# EasyEDA Pro project AD8336程控增益模块.eprj

# Schematic Schematic1
Create Date: 2024-07-12; Page Name: P1; Project Name: AD8336程控增益模块; Schematic Name: Schematic1; Update Date: 2024-07-12; Company: 嘉立创EDA; Page Size: A4; Version: V1.0
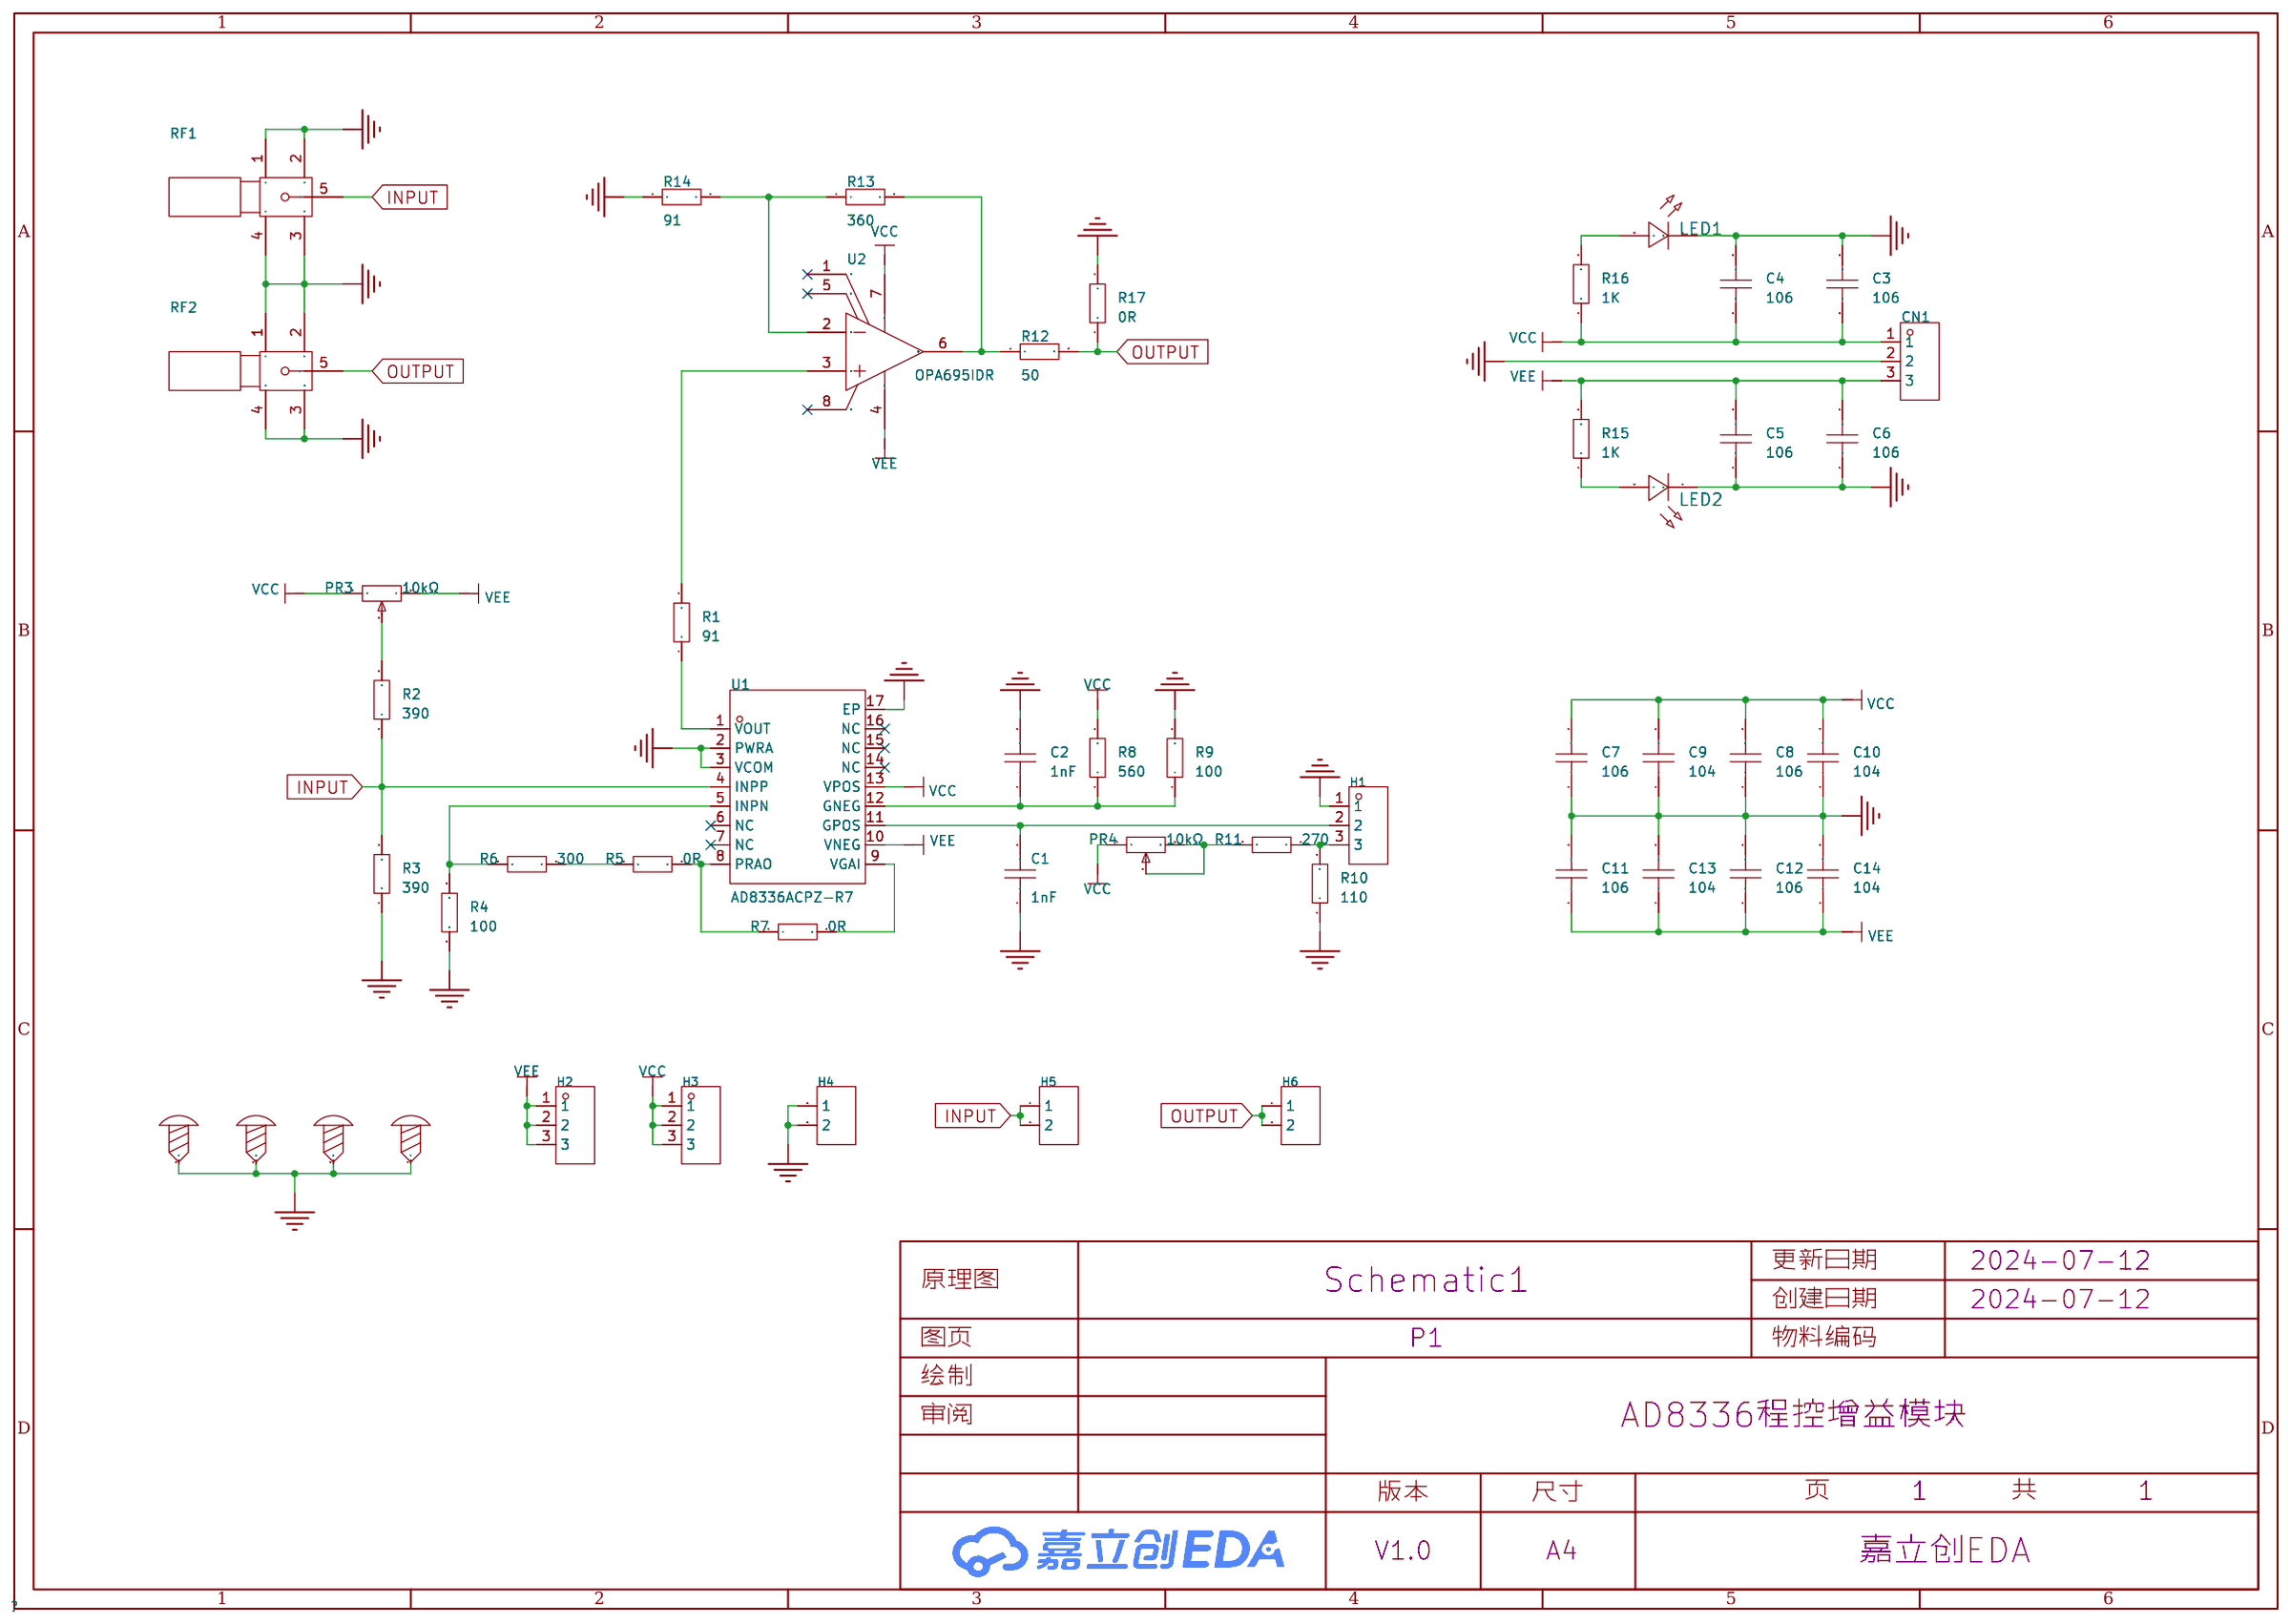
[diagram p0: schematic sheet]

## Parts
C1  1nF  [C0603]
C2  1nF  [C0603]
C3  106  [C0603]
C4  106  [C0603]
C5  106  [C0603]
C6  106  [C0603]
C7  106  [C0603]
C8  106  [C0603]
C9  104  [C0603]
C10  104  [C0603]
C11  106  [C0603]
C12  106  [C0603]
C13  104  [C0603]
C14  104  [C0603]
CN1  MX301-5.0-03P-BU01-Cu-Y-A  [CONN-TH_3P-P5.0-MX301-5.0-03P-BU01-CU-Y-A]
H1  -  [HDR-TH_3P-P2.54-V-F]
H2  -  [HDR-TH_3P-P2.54-V-F]
H3  -  [HDR-TH_3P-P2.54-V-F]
H4  -  [HDR-TH_2P-P2.54-V-F]
H5  -  [HDR-TH_2P-P2.54-V-F]
H6  -  [HDR-TH_2P-P2.54-V-F]
LED1  -  [LED_0603]
LED2  -  [LED_0603]
PR3  10kΩ  [R_3296]
PR4  10kΩ  [R_3296]
R1  91  [R0603]
R2  390  [R0603]
R3  390  [R0603]
R4  100  [R0603]
R5  0R  [R0603]
R6  300  [R0603]
R7  0R  [R0603]
R8  560  [R0603]
R9  100  [R0603]
R10  110  [R0603]
R11  270  [R0603]
R12  50  [R0603]
R13  360  [R0603]
R14  91  [R0603]
R15  1K  [R0603]
R16  1K  [R0603]
R17  0R  [R0603]
RF1  BWSMA-KE-Z001  [SMA-TH_BWSMA-KE-Z001]
RF2  BWSMA-KE-Z001  [SMA-TH_BWSMA-KE-Z001]
TP1  -  [M3螺丝]
TP2  -  [M3螺丝]
TP3  -  [M3螺丝]
TP4  -  [M3螺丝]
U1  AD8336ACPZ-R7  [LFCSP-16_L4.0-W4.0-P0.65-BL-EP2.2]
U2  OPA695IDR  [SOIC-8_L5.0-W4.0-P1.27-LS6.1-BL]

## Library data of the parts
C1-C14 = CAP_0603: Supplier Footprint: 0603
CN1 = MX301-5.0-03P-BU01-Cu-Y-A: 结构:1x3P;间距:5mm;颜色:蓝色;安装方式:直插;额定电流:16A;额定电压:300V;排数:1;线规 - AWG:14~24;线规 - 平方毫米:1.5;每排PIN数:3;触头材质:铜合金;触头镀层:锡;工作温度范围:-40℃~+105℃;; LCSC Part Name: 5mm 1x3P 排数:1 每排P数:3 直插; Supplier Part: C5188423; Manufacturer: MAX(迈旭); Supplier Footprint: 插件,P=5mm; JLCPCB Part Class: Extended Part; Datasheet: https://atta.szlcsc.com/upload/public/pdf/source/20230915/1F0A484E8C4B07E7C9BE20D191F8A304.pdf; Supplier: LCSC; Structure: 1x3P; Pitch: 5mm; Color: 蓝色; Mounting Style: 直插; Current Rating (Max): 16A; Voltage Rating (Max): 300V; Number of Pins: 3P; Number of Rows: 1; Wire Gauge - AWG: 14~24; Wire Gauge - mm2: 1.5; Number of PINs Per Row: 3; Contact Material: 铜合金; Contact Plating: 锡; Operating Temperature Range: -40℃~+105℃
H1-H3 = HDR-F_2.54_1x3P: Supplier Part: C541850; Supplier Footprint: 插件
H4-H6 = HDR-F_2.54_1x2P: Supplier Part: C49661; Supplier Footprint: 插件
LED1 LED2 = LED_0603-R: Supplier Footprint: 0603
PR3 PR4 = R_3296: Supplier Footprint: 直插
R1-R17 = Res_0603: Supplier Footprint: 0603
RF1 RF2 = BWSMA-KE-Z001_C496549: 连接器类型:板端;接口类型:内孔;端口数量:1;接口直径:-;接口长度/高度:-;频率-最大值:-;射频系列:SMA;阻抗:50Ω;样式:正脚;触头材质:-;触头镀层:-;工作温度范围:-65℃~+165℃;焊接温度(最大值):-;; LCSC Part Name: 内孔 SMA 正脚; Supplier Part: C496549; Manufacturer: BAT WIRELESS(蝙蝠无线); Supplier Footprint: 插件; JLCPCB Part Class: 扩展库; Datasheet: https://atta.szlcsc.com/upload/public/pdf/source/20221228/40BF41E56A06003A0210E1785CA66EA6.pdf; Supplier: LCSC; Connector Type: 板端; Interface Type: 内孔; Number of Ports: 1; RF Series: SMA; Impedance: 50Ω; Style: 正脚; Operating Temperature Range: -65℃~+165℃
TP1-TP4 = M3螺丝: Supplier Footprint: 插件
U1 = AD8336ACPZ-R7: 可变增益放大器-IC-信号处理-16-LFCSP-VQ（4x4）; Supplier Part: C578700; Manufacturer: ADI(亚德诺); Supplier Footprint: LFCSP-16(4x4); JLCPCB Part Class: 扩展库; Datasheet: https://atta.szlcsc.com/upload/public/pdf/source/20200820/C652712_CB62F1C22C6353105F16C6BF364AA7F1.pdf; Supplier: LCSC
U2 = OPA695IDR: 放大器数:单路;增益带宽积(GBP):-;输入偏置电流(Ib):20uA;压摆率(SR):4300V/us;带宽(-3db):1.7GHz;; Supplier Part: C1848175; Manufacturer: TI(德州仪器); Supplier Footprint: SOIC-8; JLCPCB Part Class: 扩展库; Datasheet: https://www.ti.com/cn/lit/gpn/opa695; Supplier: LCSC; Number of Circuits: 单路; Current - Input Bias(Ib): 20uA; Slew Rate(SR): 4300V/us; Output Current: 120mA; -3db Bandwidth: 1.7GHz; Operating Temperature: -40℃~+85℃

## Nets
GND: C1.1 C2.2 C3.2 C4.2 C5.1 C6.1 C7.1 C8.1 C9.1 C10.1 C11.2 C12.2 C13.2 C14.2 CN1.2 H1.1 H4.1 H4.2 LED1.1(C) LED2.1(C) R3.1 R4.1 R9.2 R10.1 R14.1 R17.2 RF1.1 RF1.2 RF1.3 RF1.4 RF2.1 RF2.2 RF2.3 RF2.4 TP1.1 TP2.1 TP3.1 TP4.1 U1.2(PWRA) U1.3(VCOM) U1.17(EP)
VCC: C3.1 C4.1 C7.2 C8.2 C9.2 C10.2 CN1.1 H3.1 H3.2 H3.3 PR3.1 PR4.1 R8.2 R16.1 U1.13(VPOS) U2.7(+VS)
VEE: C5.2 C6.2 C11.1 C12.1 C13.1 C14.1 CN1.3 H2.1 H2.2 H2.3 PR3.3 R15.2 U1.10(VNEG) U2.4(-VS)
INPUT: H5.1 H5.2 R2.1 R3.2 RF1.5 U1.4(INPP)
OUTPUT: H6.1 H6.2 R12.2 R17.1 RF2.5
$1N575: PR3.2 R2.2
$1N856: R4.2 R6.1 U1.5(INPN)
$1N865: R5.1 R6.2
$1N898: R7.2 U1.9(VGAI)
$1N903: R5.2 R7.1 U1.8(PRAO)
$1N1123: C2.1 R8.1 R9.1 U1.12(GNEG)
$1N1473: PR4.2 PR4.3 R11.2
$1N1789: R12.1 R13.2 U2.6(Output)
$1N1884: R13.1 R14.2 U2.2(-IN)
$1N1929: R1.1 U1.1(VOUT)
$1N1933: R1.2 U2.3(+IN)
$1N5466: C1.2 H1.2 U1.11(GPOS)
$1N5470: H1.3 R10.2 R11.1
Net-(LED1-2): LED1.2(A) R16.2
Net-(LED2-2): LED2.2(A) R15.1

Not connected (* = marked no-connect by the designer): U1 6(NC)* 7(NC)* 14(NC)* 15(NC)* 16(NC)*; U2 1(NC)* 5(NC)* 8(DIS#)*

# Board PCB1
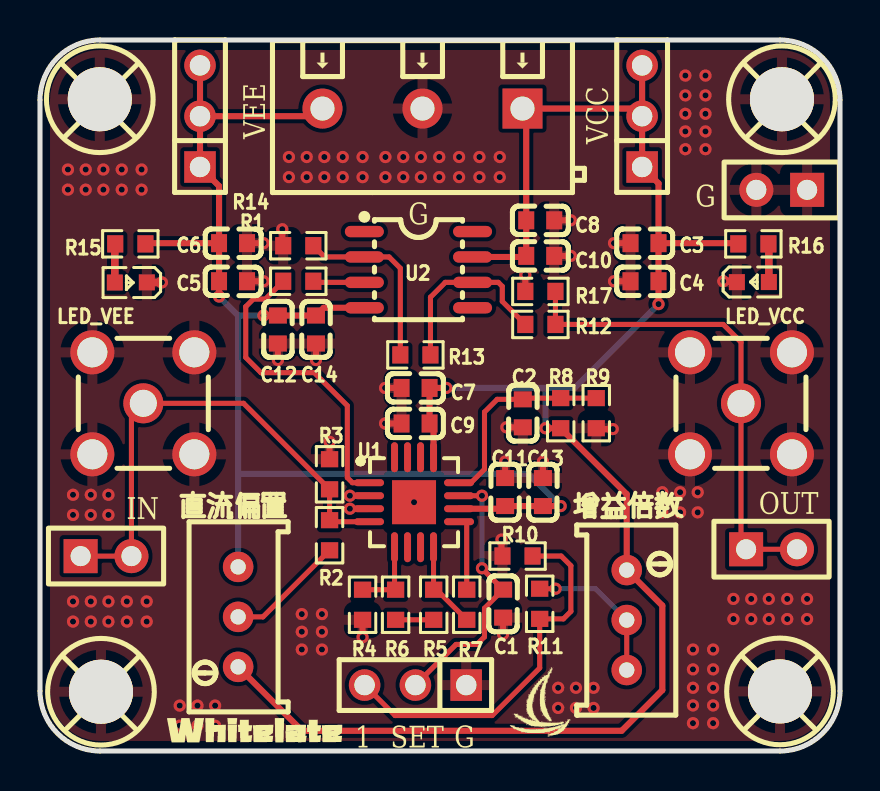
[diagram p1: board, top side]
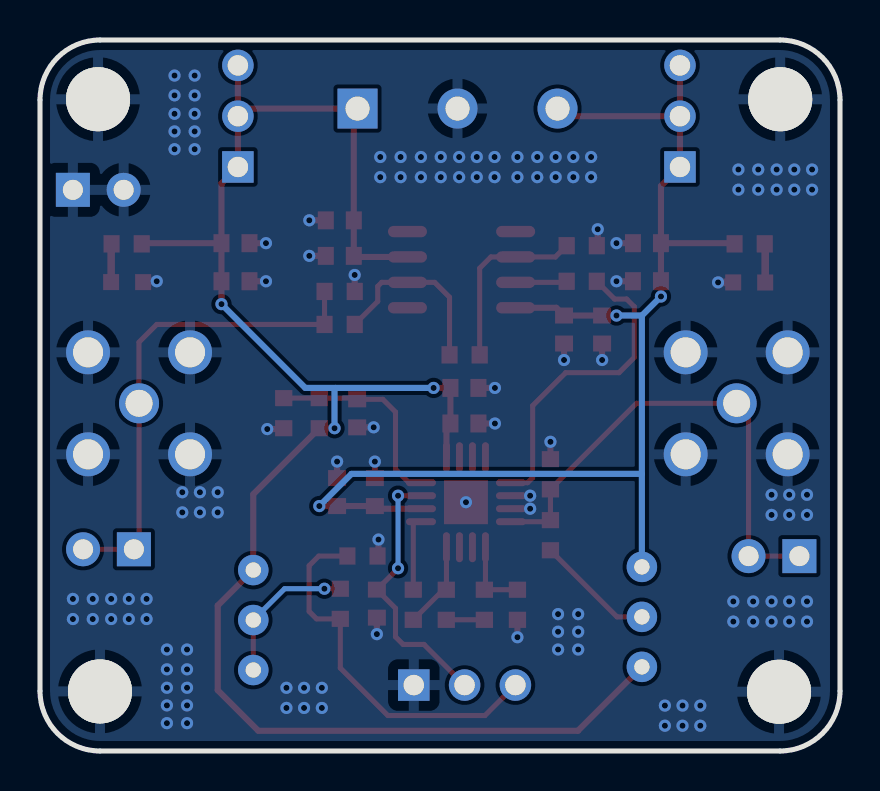
[diagram p2: board, bottom side, seen from below]

Outline 40 x 35.56 mm; copper layers: Top Layer, Bottom Layer. Coordinates in mm from the lower left corner of the outline.
Outline path: 0,32.56 0,3 arc(0.88,0.88) 3,0 37,0 arc(39.12,0.88) 40,3 40,32.56 arc(39.12,34.68) 37,35.56 3,35.56 arc(0.88,34.68) 0,32.56
Stack: Top Layer 0.035mm / Dielectric1 1.51mm FR4 er 4.5 / Bottom Layer 0.035mm

## Design rules (mm)
template: 自定义配置
spacing copperThickness1oz (default): track to track 0.102, other pairs 0.152 to 0.3
spacing copperThickness2oz: track to track 0.203, other pairs 0.152 to 0.3
track width copperThickness1oz (default): min 0.127, default 0.254, max 2.54
track width copperThickness2oz: min 0.203, default 0.254, max 2.54
differential pair differentialPair (default): width min 0.127, default 0.254, max 2.54; gap min 0.152, default 0.152
via viaSize (default): diameter min 0.5, default 0.61, max 10; hole min 0.3, default 0.305, max 6.3

## Placement (name value [footprint] x y rotation side)
C1  1nF  [C0603]  23.16 7.37 90 top
C2  1nF  [C0603]  24.14 16.89 270 top
C3  106  [C0603]  30.23 25.4 180 top
C4  106  [C0603]  30.23 23.49 180 top
C5  106  [C0603]  9.65 23.49 180 top
C6  106  [C0603]  9.65 25.4 180 top
C7  106  [C0603]  18.78 18.16 0 top
C8  106  [C0603]  25.01 26.54 180 top
C9  104  [C0603]  18.78 16.38 0 top
C10  104  [C0603]  25.01 24.76 180 top
C11  106  [C0603]  23.26 12.95 90 top
C12  106  [C0603]  11.89 21.08 270 top
C13  104  [C0603]  25.15 12.95 90 top
C14  104  [C0603]  13.8 21.08 270 top
CN1  MX301-5.0-03P-BU01-Cu-Y-A  [CONN-TH_3P-P5.0-MX301-5.0-03P-BU01-CU-Y-A]  19.12 32.13 180 top
H1  -  [HDR-TH_3P-P2.54-V-F]  18.77 3.3 180 top
H2  -  [HDR-TH_3P-P2.54-V-F]  8 31.75 90 top
H3  -  [HDR-TH_3P-P2.54-V-F]  30.11 31.75 90 top
H4  -  [HDR-TH_2P-P2.54-V-F]  37.09 28.06 180 top
H5  -  [HDR-TH_2P-P2.54-V-F]  3.3 9.74 0 top
H6  -  [HDR-TH_2P-P2.54-V-F]  36.58 10.09 0 top
LED_VCC  -  [LED_0603]  35.69 23.46 0 top
LED_VEE  -  [LED_0603]  4.49 23.42 180 top
PR3  10kΩ  [R_3296]  9.78 6.71 90 top
PR4  10kΩ  [R_3296]  29.46 6.55 270 top
R1  91  [R0603]  12.91 23.49 0 top
R2  390  [R0603]  14.48 10.79 270 top
R3  390  [R0603]  14.48 13.84 270 top
R4  100  [R0603]  16.13 7.31 90 top
R5  0R  [R0603]  19.69 7.31 90 top
R6  300  [R0603]  17.78 7.31 270 top
R7  0R  [R0603]  21.34 7.31 90 top
R8  560  [R0603]  26.03 16.89 270 top
R9  100  [R0603]  27.81 16.89 270 top
R10  110  [R0603]  23.88 9.75 0 top
R11  270  [R0603]  24.98 7.36 90 top
R12  50  [R0603]  25.02 21.33 0 top
R13  360  [R0603]  18.77 19.81 0 top
R14  91  [R0603]  12.91 25.27 0 top
R15  1K  [R0603]  4.52 25.36 0 top
R16  1K  [R0603]  35.67 25.36 0 top
R17  0R  [R0603]  25.02 22.98 180 top
RF1  BWSMA-KE-Z001  [SMA-TH_BWSMA-KE-Z001]  5.17 17.39 0 top
RF2  BWSMA-KE-Z001  [SMA-TH_BWSMA-KE-Z001]  35.05 17.39 0 top
TP1  -  [M3螺丝]  3.11 2.9 0 top
TP2  -  [M3螺丝]  37.06 2.92 0 top
TP3  -  [M3螺丝]  37.16 32.53 0 top
TP4  -  [M3螺丝]  3.05 32.53 0 top
U1  AD8336ACPZ-R7  [LFCSP-16_L4.0-W4.0-P0.65-BL-EP2.2]  18.7 12.44 270 top
U2  OPA695IDR  [SOIC-8_L5.0-W4.0-P1.27-LS6.1-BL]  18.92 24.07 270 top

## Footprints (pads in the part's own frame, mm; a bottom-side part is the same pattern mirrored in y, then rotated)
C0603
  rect 0.8x0.9 smd: 1(-0.7,0) 2(0.7,0)
CONN-TH_3P-P5.0-MX301-5.0-03P-BU01-CU-Y-A
  rect 2x2 hole 1.2: 1(-5,0)
  round 2 hole 1.2: 2(0,0) 3(5,0)
HDR-TH_2P-P2.54-V-F
  rect 1.7x1.7 hole 1: 1(-1.27,0)
  round 1.7 hole 1: 2(1.27,0)
HDR-TH_3P-P2.54-V-F
  rect 1.575x1.575 hole 1.02: 1(-2.54,0)
  round 1.575 hole 1.02: 2(0,0) 3(2.54,0)
LED_0603
  rect 0.8x0.8 smd: 1(-0.851,-0.01) 2(0.75,-0.005)
LFCSP-16_L4.0-W4.0-P0.65-BL-EP2.2
  oval 0.35x1.5 smd: 1(-0.975,-2.25) 2(-0.325,-2.25) 3(0.325,-2.25) 4(0.975,-2.25) 9(0.975,2.25) 10(0.325,2.25) 11(-0.325,2.25) 12(-0.975,2.25)
  oval 1.5x0.35 smd: 5(2.25,-0.975) 6(2.25,-0.325) 7(2.25,0.325) 8(2.25,0.975) 13(-2.25,0.975) 14(-2.25,0.325) 15(-2.25,-0.325) 16(-2.25,-0.975)
  rect 2.2x2.2 smd: 17(0,0)
M3螺丝
  round 3.2 hole 3.2: 1(-0.064,0.064)
R0603
  rect 0.806x0.864 smd: 1(-0.753,0) 2(0.753,0)
R_3296
  round 1.524 hole 0.762: 1(-2.499,-0.127) 2(0,-0.127) 3(2.499,-0.127)
SMA-TH_BWSMA-KE-Z001
  round 2.2 hole 1.5: 1(-2.55,-2.55) 2(-2.55,2.55) 3(2.55,2.55) 4(2.55,-2.55)
  round 2 hole 1.35: 5(0,0)
SOIC-8_L5.0-W4.0-P1.27-LS6.1-BL
  oval 0.569x1.95 smd: 1(-1.905,-2.705) 2(-0.635,-2.705) 3(0.635,-2.705) 4(1.905,-2.705) 5(1.905,2.705) 6(0.635,2.705) 7(-0.635,2.705) 8(-1.905,2.705)

## Nets
As in the schematic, except:
GND: C1.1 C2.2 C3.2 C4.2 C5.1 C6.1 C7.1 C8.1 C9.1 C10.1 C11.2 C12.2 C13.2 C14.2 CN1.2 H1.1 H4.1 H4.2 LED_VCC.1 LED_VEE.1 R3.1 R4.1 R9.2 R10.1 R14.1 R17.2 RF1.1 RF1.2 RF1.3 RF1.4 RF2.1 RF2.2 RF2.3 RF2.4 TP1.1 TP2.1 TP3.1 TP4.1 U1.2 U1.3 U1.17
$1N2319: LED_VEE.2 R15.1
$1N2391: LED_VCC.2 R16.2

Pads without a net: U1 6 7 14 15 16; U2 1 5 8

## Via types
v1: diameter 0.61, hole 0.305, Top Layer to Bottom Layer, 138 vias

## Routing (per net, layer and track width the routed paths; a pad name or vN(x,y) marks a point on that pad's centre or on a via; arc(x,y) is an arc through that point)
GND: length 19.8
  Top Layer w0.305: 12.11,25.27 v1(12.11,26.09) ; 14.48,14.64 v1(14.48,15.46) ; 27.81,16.1 v1(28.64,16.1) ; C10.1 v1(26.54,24.76) ; C8.1 v1(26.54,26.54) ; C6.1 v1(11.18,25.4) ; C11.2 v1(23.26,14.47) ; C2.2 v1(23.32,16.19) ; C4.2 v1(28.7,23.49) ; C13.2 v1(25.15,14.47) ; 16.13,6.51 v1(16.13,5.69) ; 23.08,9.75 v1(23.08,10.57) ; C5.1 v1(11.18,23.49) ; C7.1 v1(17.25,18.16) ; C12.2 v1(11.89,19.55) ; C9.1 v1(17.25,16.38) ; U1.2 v1(15.49,12.77) ; R17.2 v1(24.27,23.81) ; C14.2 v1(13.8,19.55) ; C3.2 v1(28.7,25.4) ; U1.3 v1(15.49,12.12) ; C1.1 v1(23.16,5.85)
  Top Layer w0.381: LED_VCC.1 34.8,23.49 v1(34.16,23.49) ; 5.34,23.43 v1(6.1,23.43)
  vias: v1(1.4,29.08) v1(1.4,28.07) v1(1.65,12.81) v1(1.65,11.81) v1(1.65,7.48) v1(1.65,6.47) v1(2.29,29.08) v1(2.29,28.07) v1(2.54,12.81) v1(2.54,11.81) v1(2.54,7.48) v1(2.54,6.47) v1(3.17,29.08) v1(3.17,28.07) v1(3.42,12.81) v1(3.42,11.81) v1(3.42,7.48) v1(3.42,6.47) v1(4.09,29.08) v1(4.09,28.07) v1(4.34,7.48) v1(4.34,6.47) v1(5.08,29.08) v1(5.08,28.07) v1(5.33,7.48) v1(5.33,6.47) v1(6.99,2.27) v1(6.99,1.27) v1(7.87,2.27) v1(7.87,1.27) v1(8.76,2.27) v1(8.76,1.27) v1(12.45,29.7) v1(12.45,28.7) v1(13.09,6.85) v1(13.09,5.96) v1(13.09,5.08) v1(13.34,29.7) v1(13.34,28.7) v1(14.1,6.85) v1(14.1,5.96) v1(14.1,5.08) v1(14.22,29.7) v1(14.22,28.7) v1(15.14,29.7) v1(15.14,28.7) v1(16.13,29.7) v1(16.13,28.7) v1(17.27,29.7) v1(17.27,28.7) v1(18.16,29.7) v1(18.16,28.7) v1(18.7,12.44) v1(19.04,29.7) v1(19.04,28.7) v1(19.96,29.7) v1(19.96,28.7) v1(20.96,29.7) v1(20.96,28.7) v1(21.97,29.7) v1(21.97,28.7) v1(22.99,29.7) v1(22.99,28.7) v1(25.91,3.16) v1(25.91,2.15) v1(26.8,3.16) v1(26.8,2.15) v1(27.68,3.16) v1(27.68,2.15) v1(31.12,12.94) v1(31.12,11.93) v1(32,12.94) v1(32,11.93) v1(32.27,33.78) v1(32.27,32.79) v1(32.27,31.86) v1(32.27,30.98) v1(32.27,30.09) v1(32.65,5.08) v1(32.65,4.08) v1(32.65,3.16) v1(32.65,2.28) v1(32.65,1.39) v1(32.89,12.94) v1(32.89,11.93) v1(33.27,33.78) v1(33.27,32.79) v1(33.27,31.86) v1(33.27,30.98) v1(33.27,30.09) v1(33.66,5.08) v1(33.66,4.08) v1(33.66,3.16) v1(33.66,2.28) v1(33.66,1.39) v1(34.67,7.61) v1(34.67,6.6) v1(35.56,7.61) v1(35.56,6.6) v1(36.44,7.61) v1(36.44,6.6) v1(37.36,7.61) v1(37.36,6.6) v1(38.35,7.61) v1(38.35,6.6)
VCC: length 90.7
  Top Layer w0.305: U2.7 24.26,24.71 C10.2 C8.2 24.31,31.94 CN1.1 29.72,32.13 H3.2 ; C3.1 C4.1 v1(30.93,22.35) ; C3.1 34.88,25.4 R16.1 ; C3.1 30.93,28.39 H3.1 H3.2 ; v1(20.32,18.16) C7.2 C9.2 19.68,16.18 U1.13 ; H3.2 H3.3 ; v1(25.27,16.14) 26.03,16.14 29.34,12.84 PR4.1 31.12,7.27 31.12,3.04 29.08,1.01 13.1,1.01 PR3.1
  Bottom Layer w0.305: 25.23,18.16 26.74,18.16 v1(30.93,22.35) ; 25.23,18.16 v1(20.32,18.16) ; 25.23,18.16 25.27,18.11 v1(25.27,16.14)
VEE: length 64.3
  Top Layer w0.305: U2.4 14.19,22.17 C14.1 C12.1 v1(11.18,21.78) ; v1(26.03,12.25) C13.1 C11.1 23.12,12.12 U1.10 ; C6.2 8.95,28.25 H2.1 H2.2 ; C6.2 C5.2 v1(8.95,22.73) ; C6.2 5.3,25.4 R15.2 ; H2.2 13.74,31.75 CN1.3 ; H2.2 H2.3
  Bottom Layer w0.305: 9.9,21.78 v1(11.18,21.78) ; 9.9,21.78 9.91,21.77 9.91,13.86 ; 9.9,21.78 v1(8.95,22.73) ; PR3.3 9.91,13.86 ; 9.91,13.86 24.43,13.86 v1(26.03,12.25)
INPUT: length 25.1
  Top Layer w0.254: H5.1 H5.2 4.57,16.79 RF1.5 10.18,17.39 R3.2 R2.1 14.56,11.47 U1.4
OUTPUT: length 24.3
  Top Layer w0.254: H6.2 H6.1 35.05,10.35 RF2.5 35.05,17.39 35.05,20.44 34.16,21.33 R12.2 R17.1
$1N575: length 6
  Top Layer w0.254: R2.2 11.15,6.71 PR3.2
$1N856: length 3.8
  Top Layer w0.254: R4.2 R6.1 17.73,8.12 U1.5
$1N865: length 1.9
  Top Layer w0.254: R6.2 R5.1
$1N898: length 3.8
  Top Layer w0.254: R7.2 21.34,11.47 U1.9
$1N903: length 4.4
  Top Layer w0.254: U1.8 19.68,8.07 R5.2 19.83,8.07 R7.1
$1N1123: length 10.3
  Top Layer w0.254: U1.12 21.55,13.42 22.22,14.09 22.22,16.95 22.86,17.59 C2.1 24.2,17.65 R8.1 R9.1
$1N1473: length 7.5
  Top Layer w0.254: R11.2 v1(25.78,8.11) ; PR4.3 PR4.2
  Bottom Layer w0.254: v1(25.78,8.11) 27.77,8.11 PR4.2
$1N1789: length 9.2
  Top Layer w0.254: R13.2 19.52,22.69 20.26,23.44 U2.6 22.91,23.44 23.11,23.24 23.11,22.48 R12.1
$1N1884: length 9.2
  Top Layer w0.254: R14.2 14.23,24.71 U2.2 17.45,24.71 18.02,24.14 R13.1
$1N1929: length 15.8
  Top Layer w0.254: U1.1 15.62,13.42 15.37,13.67 15.37,17.27 13.72,18.92 11.05,18.92 10.29,19.68 10.29,22.22 10.67,22.6 11.27,22.6 R1.1
$1N1933: length 2.6
  Top Layer w0.254: U2.3 13.72,23.44 R1.2
$1N2319: length 1.9
  Top Layer w0.381: LED_VEE.2 3.74,25.34 3.76,25.36
$1N2391: length 1.9
  Top Layer w0.381: LED_VCC.2 36.44,25.34 R16.2
$1N5466: length 13.5
  Top Layer w0.254: H1.2 20.8,5.33 21.84,5.33 22.22,5.71 22.22,7.14 C1.2 22.1,9.13 v1(22.1,9.14) ; U1.11 v1(22.1,12.77)
  Bottom Layer w0.254: v1(22.1,9.14) v1(22.1,12.77)
$1N5470: length 18.9
  Top Layer w0.254: H1.3 17.75,1.77 22.61,1.77 24.98,4.15 R11.1 26.17,6.61 26.54,6.98 26.54,9.27 26.06,9.75 R10.2

## Copper pours and planes (outline as drawn; the poured copper is in the pictures)
GND on Top Layer: -0.38,36.19 40.64,36.19 40.64,-1.15 -0.38,-1.15
GND on Top Layer: -1.4,36.95 41.66,36.95 41.66,-1.15 -1.4,-1.15
GND on Bottom Layer: -1.4,36.95 41.28,36.95 41.28,-0.89 -1.4,-0.89

## Text on the board
Top Silkscreen Layer: IN | 直流偏置 | 1 | SET | G | 增益倍数 | OUT | VEE | VCC
